# Altium project 菠萝万能控 V4.PrjPcb
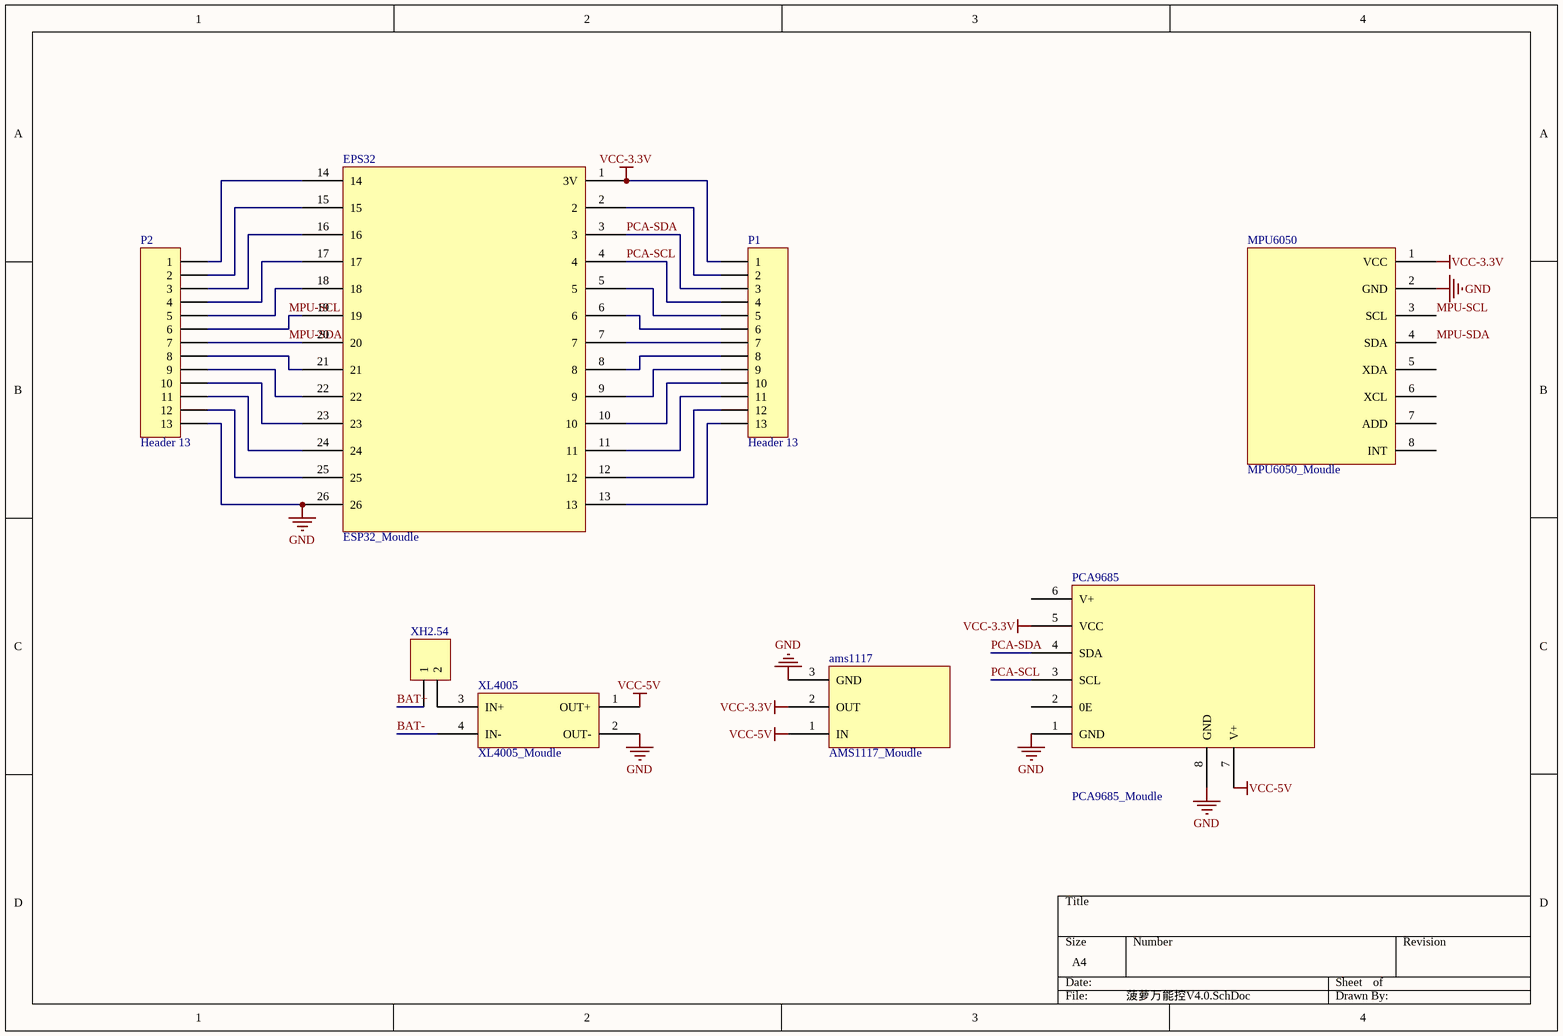
[diagram p0: 菠萝万能控V4.0.SchDoc]
1 sheet, 8 parts. Net scope: global (net labels, ports and power ports of the same name join across sheets).
Board file: 菠萝万能控V4.0.pcbdoc

## Sheet 菠萝万能控V4.0.SchDoc
size A4

### Parts
ams1117  AMS1117_Moudle  [AMS1117_Moudle]
EPS32  ESP32_Moudle  [ESP32_Moudle]
MPU6050  MPU6050_Moudle  [MPU6050_Moudle]
P1  Header 13  [HDR1X13]
P2  Header 13  [HDR1X13]
PCA9685  PCA9685_Moudle  [PCA9685_Moudle]
XH2.54  Header 2  [HDR1X2]  (value not drawn)
XL4005  XL4005_Moudle  [XL4005_Moudle]

### Nets
GND: ams1117.3(GND) EPS32.26 MPU6050.2(GND) P2.13 PCA9685.1(GND) PCA9685.8(GND) XL4005.2(OUT-)
VCC-3.3V: ams1117.2(OUT) EPS32.1(3V) MPU6050.1(VCC) P1.1 PCA9685.5(VCC)
VCC-5V: ams1117.1(IN) PCA9685.7(V+) XL4005.1(OUT+)
BAT+: XH2.54.1
BAT-: XL4005.4(IN-)
MPU-SCL: EPS32.19 MPU6050.3(SCL) P2.6
MPU-SDA: EPS32.20 MPU6050.4(SDA) P2.7
PCA-SCL: EPS32.4 P1.4 PCA9685.3(SCL)
PCA-SDA: EPS32.3 P1.3 PCA9685.4(SDA)
NetEPS32_2: EPS32.2 P1.2
NetEPS32_5: EPS32.5 P1.5
NetEPS32_6: EPS32.6 P1.6
NetEPS32_7: EPS32.7 P1.7
NetEPS32_8: EPS32.8 P1.8
NetEPS32_9: EPS32.9 P1.9
NetEPS32_10: EPS32.10 P1.10
NetEPS32_11: EPS32.11 P1.11
NetEPS32_12: EPS32.12 P1.12
NetEPS32_13: EPS32.13 P1.13
NetEPS32_14: EPS32.14 P2.1
NetEPS32_15: EPS32.15 P2.2
NetEPS32_16: EPS32.16 P2.3
NetEPS32_17: EPS32.17 P2.4
NetEPS32_18: EPS32.18 P2.5
NetEPS32_21: EPS32.21 P2.8
NetEPS32_22: EPS32.22 P2.9
NetEPS32_23: EPS32.23 P2.10
NetEPS32_24: EPS32.24 P2.11
NetEPS32_25: EPS32.25 P2.12
NetXH2.54_2: XH2.54.2 XL4005.3(IN+)

Not connected (* = marked no-connect by the designer): MPU6050 5(XDA) 6(XCL) 7(ADD) 8(INT); PCA9685 2(0E) 6(V+)

### Library data of the parts
P1 P2 = Header 13: Header, 13-Pin; LatestRevisionDate: 17-Jul-2002; LatestRevisionNote: Re-released for DXP Platform.; Publisher: Altium Limited
XH2.54 = Header 2: Header, 2-Pin; LatestRevisionDate: 17-Jul-2002; LatestRevisionNote: Re-released for DXP Platform.; Publisher: Altium Limited